# EAGLE design Trolly (EAGLE 9.5.2)
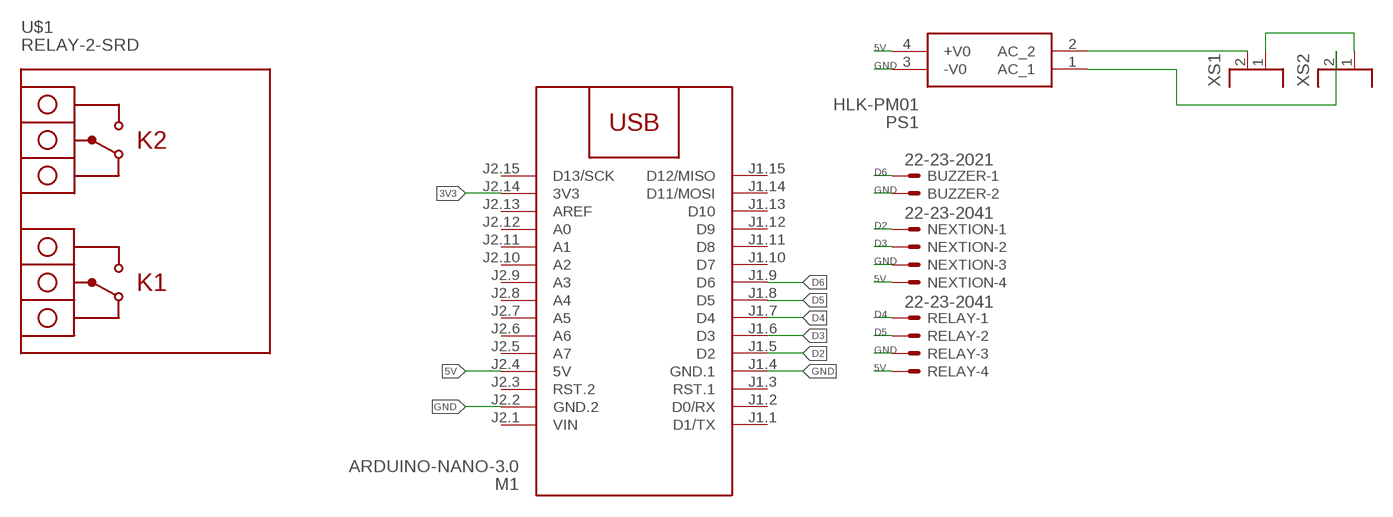
[diagram p0: schematic, sheet 1]

## Parts
BUZZER  22-23-2021  [22-23-2021]
M1  ARDUINO-NANO-3.0  [ARDUINO-NANO-3.0]
NEXTION  22-23-2041  [22-23-2041]
PS1  HLK-PM01  [HLKPM01]
RELAY  22-23-2041  [22-23-2041]
U$1  RELAY-2-SRD  [RELAY-2-SRD]
XS1  2P  [DG55CB-2P-1]
XS2  2P  [DG55CB-2P-1]

## Nets
3V3: M1.J2.14(3V3)
5V: M1.J2.4(5V) NEXTION.4 PS1.4(+V0) RELAY.4
D2: M1.J1.5(D2) NEXTION.1
D3: M1.J1.6(D3) NEXTION.2
D4: M1.J1.7(D4) RELAY.1
D5: M1.J1.8(D5) RELAY.2
D6: BUZZER.1 M1.J1.9(D6)
GND: BUZZER.2 M1.J1.4(GND.1) M1.J2.2(GND.2) NEXTION.3 PS1.3(-V0) RELAY.3
N$1: XS1.1 XS2.1
N$2: PS1.1(AC_1) XS2.2
N$3: PS1.2(AC_2) XS1.2
Unconnected: M1.J1.1(D1/TX) M1.J1.2(D0/RX) M1.J1.3(RST.1) M1.J1.10(D7) M1.J1.11(D8) M1.J1.12(D9) M1.J1.13(D10) M1.J1.14(D11/MOSI) M1.J1.15(D12/MISO) M1.J2.3(RST.2) M1.J2.5(A7) M1.J2.6(A6) M1.J2.7(A5) M1.J2.8(A4) M1.J2.9(A3) M1.J2.10(A2) M1.J2.11(A1) M1.J2.12(A0) M1.J2.13(AREF) M1.J2.15(D13/SCK)

## Power pins joined to a net without a drawn wire
VIN: M1.J2.1(VIN)

## Library data of the parts
BUZZER = con-molex:22-23-2021: .100" (2.54mm) Center Header - 2 Pin; MF: MOLEX; MPN: 22-23-2021; OC_FARNELL: 1462926; OC_NEWARK: 25C3832
M1 = diy-modules:ARDUINO-NANO-3.0: Arduino Nano 3.0 and compatible devices More details available here: https://www.arduino.cc/en/Main/ArduinoBoardNano Click here to find device on ebay.com <http://www.ebay.com/sch/arduino+nano>
NEXTION RELAY = con-molex:22-23-2041: .100" (2.54mm) Center Header - 4 Pin; MF: MOLEX; MPN: 22-23-2041; OC_FARNELL: 1462920; OC_NEWARK: 38C0355
PS1 = HLK-PM01:HLK-PM01: Ultra-compact power module Source: Datasheet <https://datasheet.lcsc.com/szlcsc/1906201102_HI-LINK-HLK-PM03_C209904.pdf> Check prices <https://pricing.snapeda.com/parts/hlk-pm01/Hi-link/view-part?ref=eda>; AVAILABILITY: No availability data; DESCRIPTION: The 3W ultra-small series module power supply is a small-volume, high-efficiency AC DC power module supply designed by Shenzhen Hi-Link Electronics Co.,Ltd. It has the advantages of global input voltage range, low temperature rise, low power consumption,high efficiency, high reliability and high safety isolation. It has been widely used in smart home, automation control, communications equipment, instrumentation and other industries.; MF: Hi-link; MP: hlk-pm01; PACKAGE: Package; PRICE: None
U$1 = diy-modules:RELAY-2-SRD: 2-Channel Relay Module based on SRD-05VDC-SL-C relays Click here to find device on ebay.com <http://www.ebay.com/sch/two+channel+relay+module+optocoupler+5v>
XS1 XS2 = con-dg55:2P: DEGSON DG55 CONNECTOR

## Board
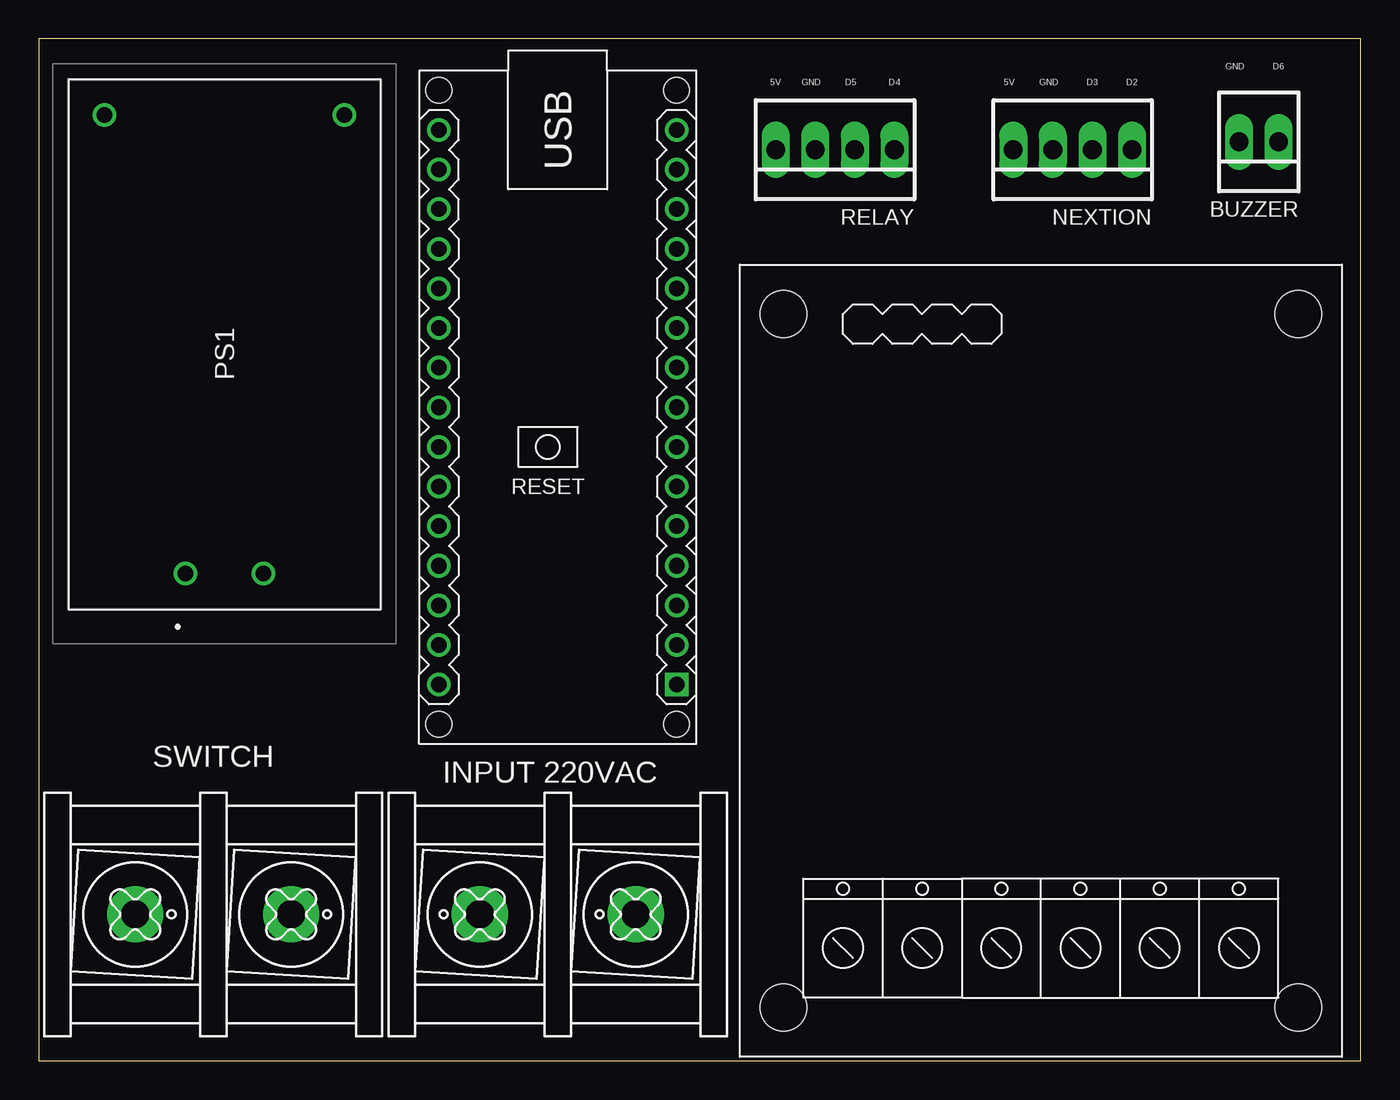
[diagram p1: board, top side]
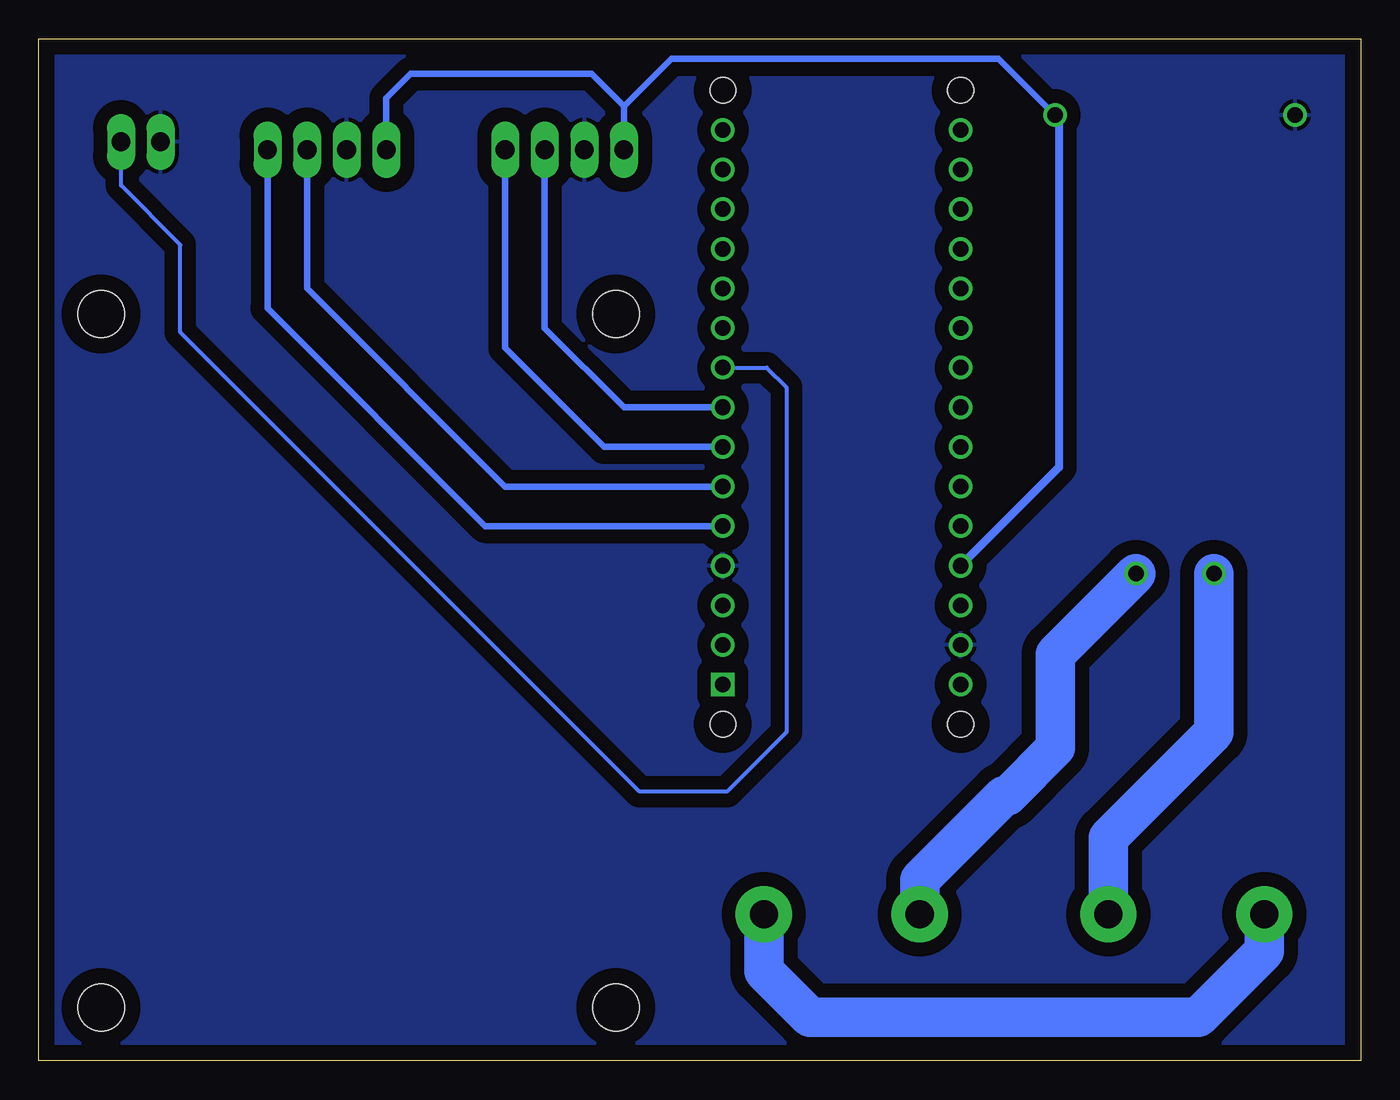
[diagram p2: board, bottom side, seen from below]

Size 84.76 x 65.52 mm. Coordinates in mm from the lower left corner, seen from the top.
Outline: 0,0 84.76,0 84.76,65.52 0,65.52 0,0
Copper layers (1*16): Top 0.035mm / dielectric 1.5mm / Bottom 0.035mm
Design rules "default": minimum track width 6mil, minimum drill 0.35mm, track to track 6mil, track to pad 6mil, pad to pad 6mil, via to via 6mil, smd to smd 6mil, copper to edge 40mil, drill to drill 6mil, minimum pad ring 10mil, minimum via ring 8mil, stop-mask expansion 4mil, vias tented up to drill 0mil, thermal gap 10mil

### Footprints (pad centres in the part's own frame; a part is rotated, then mirrored left to right if it is on the bottom)
22-23-2021 = drill 1.2 long: 1 -1.27,0; 2 1.27,0
ARDUINO-NANO-3.0 = drill 1 square: J1.1 17.78,7.62 | drill 1: J1.2 15.24,7.62; J1.3 12.7,7.62; J1.4 10.16,7.62; J1.5 7.62,7.62; J1.6 5.08,7.62; J1.7 2.54,7.62; J1.8 0,7.62; J1.9 -2.54,7.62; J1.10 -5.08,7.62; J1.11 -7.62,7.62; J1.12 -10.16,7.62; J1.13 -12.7,7.62; J1.14 -15.24,7.62; J1.15 -17.78,7.62; J2.1 17.78,-7.62; J2.2 15.24,-7.62; J2.3 12.7,-7.62; J2.4 10.16,-7.62; J2.5 7.62,-7.62; J2.6 5.08,-7.62; J2.7 2.54,-7.62; J2.8 0,-7.62; J2.9 -2.54,-7.62; J2.10 -5.08,-7.62; J2.11 -7.62,-7.62; J2.12 -10.16,-7.62; J2.13 -12.7,-7.62; J2.14 -15.24,-7.62; J2.15 -17.78,-7.62 | hole 1.651: -20.32,7.62; -20.32,-7.62; 20.32,-7.62; 20.32,7.62
22-23-2041 = drill 1.2 long: 1 -3.81,0; 2 -1.27,0; 3 1.27,0; 4 3.81,0
HLKPM01 = drill 1 pad 1.5: 1 0,0; 2 0,-5; 3 29.4,5.2; 4 29.4,-10.2
RELAY-2-SRD = hole 3: -22.225,16.51; 22.225,16.51; 22.225,-16.51; -22.225,-16.51
DG55CB-2P-1 = drill 1.8 pad 3.6: 1 -5,0; 2 5,0

### Placement (x,y rotation side)
BUZZER  78.23,58.93 180 top
M1  33.27,41.91 270 top
NEXTION  66.29,58.42 180 top
PS1  9.4,31.24 90 top
RELAY  51.05,58.42 180 top
U$1  64.26,25.65 90 top
XS1  33.27,9.4 180 top
XS2  11.18,9.4 0 top

### Tracks (layer width: path | path; a pad name or v marks a point on that pad's centre or on a via)
5V
  Bottom 0.406: RELAY.4 47.24,61.21 | 47.24,61.21 44.2,64.26 23.22,64.26 PS1.4 | 47.24,61.21 49.32,63.29 60.92,63.29 62.48,61.72 NEXTION.4
  Bottom 0.508: PS1.4 19.34,60.39 19.34,38.06 M1.J2.4
D2
  Bottom 0.406: NEXTION.1 70.1,48.26 56.13,34.29 M1.J1.5
D3
  Bottom 0.406: NEXTION.2 67.56,49.53 54.86,36.83 M1.J1.6
D4
  Bottom 0.406: RELAY.1 54.86,45.72 48.51,39.37 M1.J1.7
D5
  Bottom 0.406: RELAY.2 52.32,46.99 47.24,41.91 M1.J1.8
D6
  Bottom 0.254: M1.J1.9 38.1,44.45 36.83,43.18 36.83,21.08 40.64,17.27 46.23,17.27 75.69,46.74 75.69,52.32 79.5,56.13 BUZZER.1
GND
  pour Bottom (isolate 0.889): 0,65.53 84.58,65.53 84.58,60.45 84.58,0 0,0
N$1
  Bottom 2.54: XS1.1 38.27,5.76 35.31,2.79 10.41,2.79 6.18,7.03 XS2.1
N$2
  Bottom 2.54: PS1.1 9.4,21.08 16.18,14.3 XS2.2
N$3
  Bottom 2.54: PS1.2 19.56,26.08 19.56,20.07 22.61,17.02 22.86,17.02 28.27,11.6 XS1.2

### Text on the board
tNames: GND | D6 | 5V | GND | D5 | D4 | 5V | GND | D3 | D2 | SWITCH | INPUT 220VAC